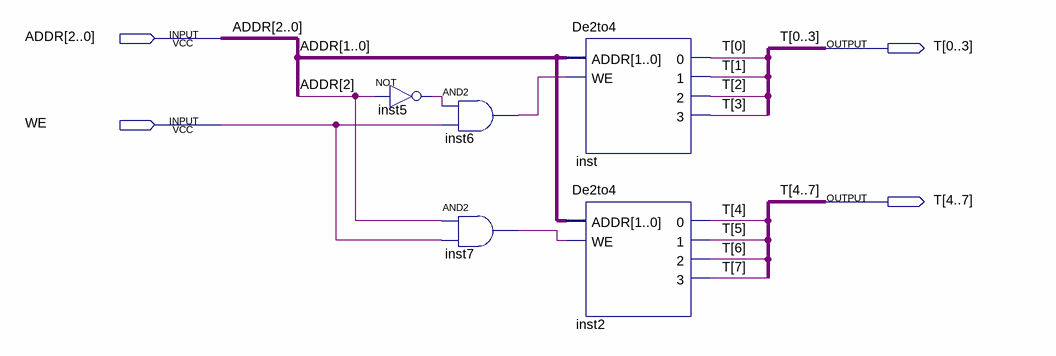
[diagram p0: schematic sheet]
// Quartus schematic De3to8.bdf as structural Verilog: 5 symbols, 4 pins
module De3to8 (
  input  [2:0] ADDR,
  input  WE,
  output [0:7] T
);

  wire inst5_out, inst6_out, inst7_out;

  not inst5 (inst5_out, ADDR[2]);
  and inst6 (inst6_out, inst5_out, WE);
  and inst7 (inst7_out, ADDR[2], WE);
  De2to4 inst (.ADDR(ADDR[1:0]), .WE(inst6_out), .\0 (T[0]), .\1 (T[1]), .\2 (T[2]), .\3 (T[3]));
  De2to4 inst2 (.ADDR(ADDR[1:0]), .WE(inst7_out), .\0 (T[4]), .\1 (T[5]), .\2 (T[6]), .\3 (T[7]));
endmodule
